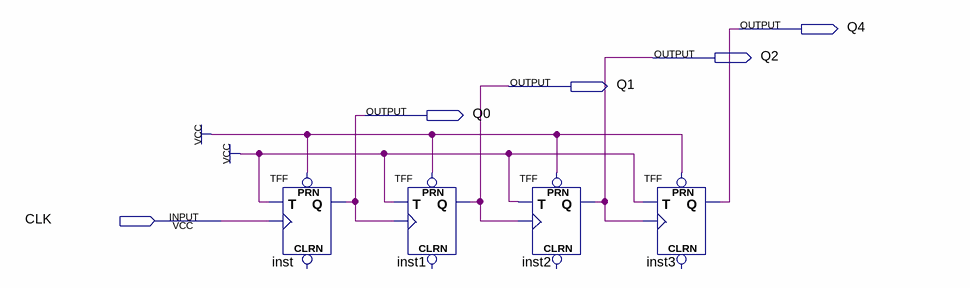
[diagram p0: schematic sheet]
// Quartus schematic bloco_contador.bdf as structural Verilog: 4 symbols, 5 pins
module bloco_contador (
  input  CLK,
  output Q4,
  output Q2,
  output Q1,
  output Q0
);

  TFF inst (.PRN(1'b1), .T(1'b1), .CLK(CLK), .Q(Q0));  // open: CLRN
  TFF inst1 (.PRN(1'b1), .T(1'b1), .CLK(Q0), .Q(Q1));  // open: CLRN
  TFF inst2 (.PRN(1'b1), .T(1'b1), .CLK(Q1), .Q(Q2));  // open: CLRN
  TFF inst3 (.PRN(1'b1), .T(1'b1), .CLK(Q2), .Q(Q4));  // open: CLRN
endmodule
